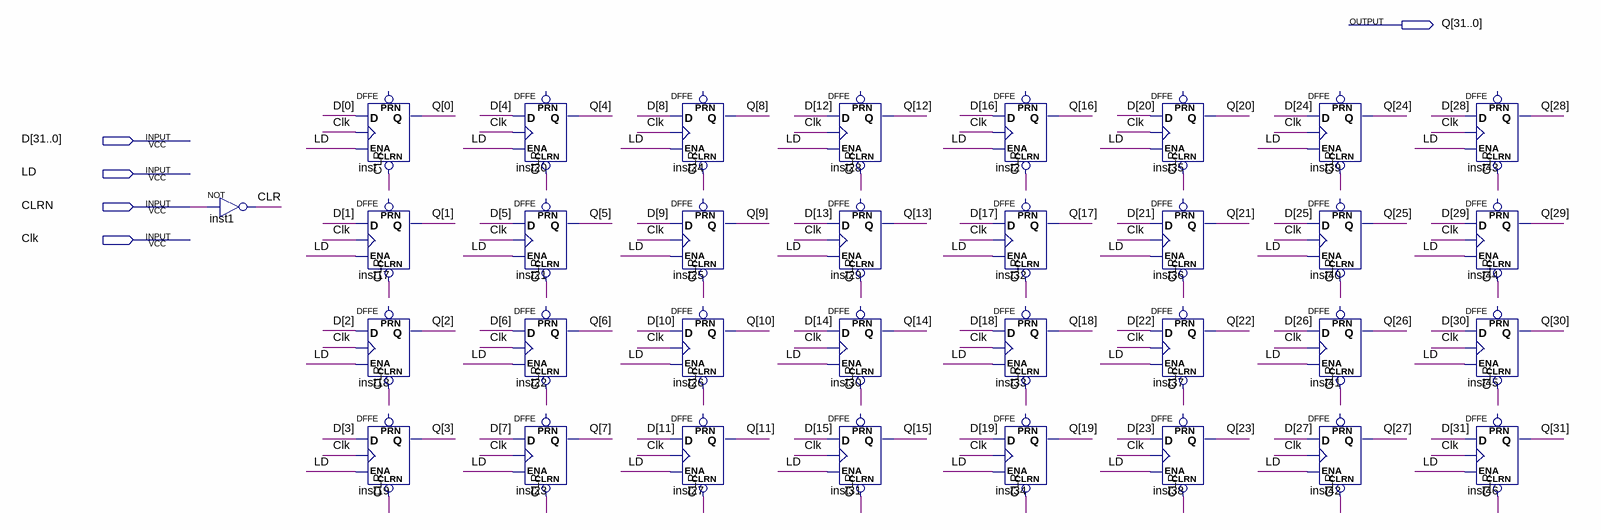
[diagram p0: schematic sheet]
// Quartus schematic reg32bit.bdf as structural Verilog: 33 symbols, 5 pins
module reg32bit (
  input  [31:0] D,
  input  LD,
  input  CLRN,
  input  Clk,
  output [31:0] Q
);

  wire CLR;

  not inst1 (CLR, CLRN);
  DFFE inst (.CLRN(CLR), .D(D[0]), .CLK(Clk), .ENA(LD), .Q(Q[0]));  // open: PRN
  DFFE inst17 (.CLRN(CLR), .D(D[1]), .CLK(Clk), .ENA(LD), .Q(Q[1]));  // open: PRN
  DFFE inst18 (.CLRN(CLR), .D(D[2]), .CLK(Clk), .ENA(LD), .Q(Q[2]));  // open: PRN
  DFFE inst19 (.CLRN(CLR), .D(D[3]), .CLK(Clk), .ENA(LD), .Q(Q[3]));  // open: PRN
  DFFE inst20 (.CLRN(CLR), .D(D[4]), .CLK(Clk), .ENA(LD), .Q(Q[4]));  // open: PRN
  DFFE inst21 (.CLRN(CLR), .D(D[5]), .CLK(Clk), .ENA(LD), .Q(Q[5]));  // open: PRN
  DFFE inst22 (.CLRN(CLR), .D(D[6]), .CLK(Clk), .ENA(LD), .Q(Q[6]));  // open: PRN
  DFFE inst23 (.CLRN(CLR), .D(D[7]), .CLK(Clk), .ENA(LD), .Q(Q[7]));  // open: PRN
  DFFE inst24 (.CLRN(CLR), .D(D[8]), .CLK(Clk), .ENA(LD), .Q(Q[8]));  // open: PRN
  DFFE inst25 (.CLRN(CLR), .D(D[9]), .CLK(Clk), .ENA(LD), .Q(Q[9]));  // open: PRN
  DFFE inst26 (.CLRN(CLR), .D(D[10]), .CLK(Clk), .ENA(LD), .Q(Q[10]));  // open: PRN
  DFFE inst27 (.CLRN(CLR), .D(D[11]), .CLK(Clk), .ENA(LD), .Q(Q[11]));  // open: PRN
  DFFE inst28 (.CLRN(CLR), .D(D[12]), .CLK(Clk), .ENA(LD), .Q(Q[12]));  // open: PRN
  DFFE inst29 (.CLRN(CLR), .D(D[13]), .CLK(Clk), .ENA(LD), .Q(Q[13]));  // open: PRN
  DFFE inst30 (.CLRN(CLR), .D(D[14]), .CLK(Clk), .ENA(LD), .Q(Q[14]));  // open: PRN
  DFFE inst31 (.CLRN(CLR), .D(D[15]), .CLK(Clk), .ENA(LD), .Q(Q[15]));  // open: PRN
  DFFE inst2 (.CLRN(CLR), .D(D[16]), .CLK(Clk), .ENA(LD), .Q(Q[16]));  // open: PRN
  DFFE inst32 (.CLRN(CLR), .D(D[17]), .CLK(Clk), .ENA(LD), .Q(Q[17]));  // open: PRN
  DFFE inst33 (.CLRN(CLR), .D(D[18]), .CLK(Clk), .ENA(LD), .Q(Q[18]));  // open: PRN
  DFFE inst34 (.CLRN(CLR), .D(D[19]), .CLK(Clk), .ENA(LD), .Q(Q[19]));  // open: PRN
  DFFE inst35 (.CLRN(CLR), .D(D[20]), .CLK(Clk), .ENA(LD), .Q(Q[20]));  // open: PRN
  DFFE inst36 (.CLRN(CLR), .D(D[21]), .CLK(Clk), .ENA(LD), .Q(Q[21]));  // open: PRN
  DFFE inst37 (.CLRN(CLR), .D(D[22]), .CLK(Clk), .ENA(LD), .Q(Q[22]));  // open: PRN
  DFFE inst38 (.CLRN(CLR), .D(D[23]), .CLK(Clk), .ENA(LD), .Q(Q[23]));  // open: PRN
  DFFE inst39 (.CLRN(CLR), .D(D[24]), .CLK(Clk), .ENA(LD), .Q(Q[24]));  // open: PRN
  DFFE inst40 (.CLRN(CLR), .D(D[25]), .CLK(Clk), .ENA(LD), .Q(Q[25]));  // open: PRN
  DFFE inst41 (.CLRN(CLR), .D(D[26]), .CLK(Clk), .ENA(LD), .Q(Q[26]));  // open: PRN
  DFFE inst42 (.CLRN(CLR), .D(D[27]), .CLK(Clk), .ENA(LD), .Q(Q[27]));  // open: PRN
  DFFE inst43 (.CLRN(CLR), .D(D[28]), .CLK(Clk), .ENA(LD), .Q(Q[28]));  // open: PRN
  DFFE inst44 (.CLRN(CLR), .D(D[29]), .CLK(Clk), .ENA(LD), .Q(Q[29]));  // open: PRN
  DFFE inst45 (.CLRN(CLR), .D(D[30]), .CLK(Clk), .ENA(LD), .Q(Q[30]));  // open: PRN
  DFFE inst46 (.CLRN(CLR), .D(D[31]), .CLK(Clk), .ENA(LD), .Q(Q[31]));  // open: PRN
endmodule
